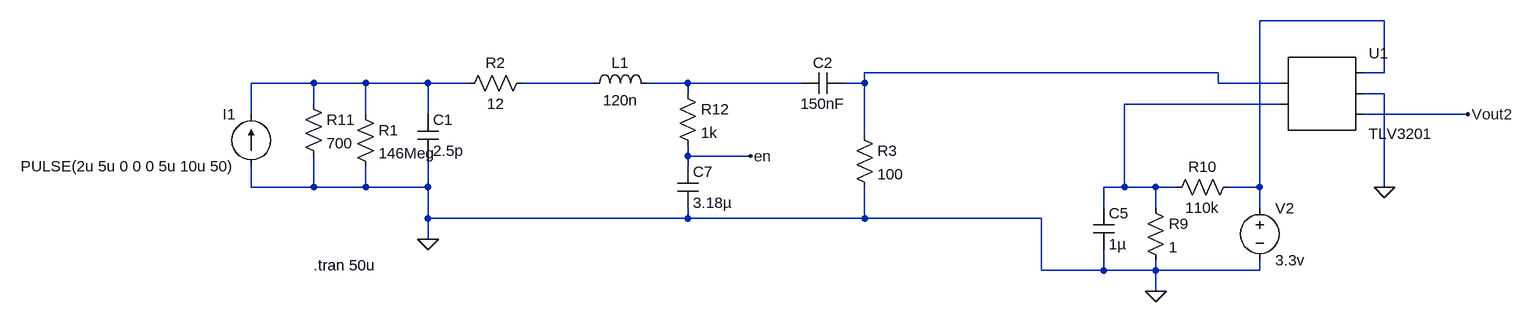
[diagram p0: schematic Draft1.asc]
Draft1.asc, the LTspice schematic file:
Version 4
SHEET 1 1968 736
WIRE 912 272 720 272
WIRE 656 352 112 352
WIRE 912 352 912 272
WIRE 912 352 880 352
WIRE -736 368 -832 368
WIRE -656 368 -736 368
WIRE -560 368 -656 368
WIRE -496 368 -560 368
WIRE -304 368 -416 368
WIRE -160 368 -224 368
WIRE 16 368 -160 368
WIRE 112 368 112 352
WIRE 112 368 80 368
WIRE 656 368 656 352
WIRE 752 368 656 368
WIRE -160 384 -160 368
WIRE 912 384 880 384
WIRE -736 400 -736 368
WIRE 752 400 512 400
WIRE -832 416 -832 368
WIRE -656 416 -656 368
WIRE -560 416 -560 368
WIRE 1040 416 880 416
WIRE 112 448 112 368
WIRE -160 480 -160 464
WIRE -64 480 -160 480
WIRE -160 496 -160 480
WIRE -832 528 -832 496
WIRE -736 528 -736 480
WIRE -736 528 -832 528
WIRE -656 528 -656 496
WIRE -656 528 -736 528
WIRE -560 528 -560 480
WIRE -560 528 -656 528
WIRE 512 528 512 400
WIRE 512 528 480 528
WIRE 560 528 512 528
WIRE 592 528 560 528
WIRE 720 528 720 272
WIRE 720 528 672 528
WIRE 912 528 912 384
WIRE 480 560 480 528
WIRE 560 560 560 528
WIRE 720 560 720 528
WIRE -560 576 -560 528
WIRE -160 576 -160 560
WIRE -160 576 -560 576
WIRE 112 576 112 528
WIRE 112 576 -160 576
WIRE 384 576 112 576
WIRE -560 608 -560 576
WIRE 384 656 384 576
WIRE 480 656 480 624
WIRE 480 656 384 656
WIRE 560 656 560 640
WIRE 560 656 480 656
WIRE 720 656 720 640
WIRE 720 656 560 656
WIRE 560 688 560 656
FLAG -560 608 0
FLAG 912 528 0
FLAG 560 688 0
FLAG 1040 416 Vout2
FLAG -64 480 en
SYMBOL res -672 400 R0
SYMATTR InstName R1
SYMATTR Value 146Meg
SYMBOL cap -576 416 R0
SYMATTR InstName C1
SYMATTR Value 2.5p
SYMBOL res -400 352 R90
WINDOW 0 0 56 VBottom 2
WINDOW 3 32 56 VTop 2
SYMATTR InstName R2
SYMATTR Value 12
SYMBOL current -832 496 R180
WINDOW 3 24 0 Left 2
WINDOW 0 24 80 Left 2
SYMATTR Value PULSE(2u 5u 0 0 0 5u 10u 50)
SYMATTR InstName I1
SYMATTR Value2 AC .5u 0
SYMBOL Cap 80 352 R90
WINDOW 0 0 32 VBottom 2
WINDOW 3 32 32 VTop 2
SYMATTR InstName C2
SYMATTR Value 150nF
SYMBOL ind -320 384 R270
WINDOW 0 32 56 VTop 2
WINDOW 3 5 56 VBottom 2
SYMATTR InstName L1
SYMATTR Value 120n
SYMBOL Res 96 432 R0
SYMATTR InstName R3
SYMATTR Value 100
SYMBOL AutoGenerated/TLV3201 816 384 R0
SYMATTR InstName U1
SYMBOL Cap 464 560 R0
SYMATTR InstName C5
SYMATTR Value 1µ
SYMBOL Res 544 544 R0
SYMATTR InstName R9
SYMATTR Value 1
SYMBOL Voltage 720 544 R0
SYMATTR InstName V2
SYMATTR Value 3.3v
SYMBOL Res 688 512 R90
WINDOW 0 0 56 VBottom 2
WINDOW 3 32 56 VTop 2
SYMATTR InstName R10
SYMATTR Value 110k
SYMBOL Res -752 384 R0
SYMATTR InstName R11
SYMATTR Value 700
SYMBOL Res -176 368 R0
SYMATTR InstName R12
SYMATTR Value 1k
SYMBOL Cap -176 496 R0
SYMATTR InstName C7
SYMATTR Value 3.18µ
TEXT -736 648 Left 2 !.tran 50u

The netlist it stands for:
* Draft1.asc
R1 N003 0 146Meg
C1 N003 0 2.5p
R2 N004 N003 12
I1 0 N003 PULSE(2u 5u 0 0 0 5u 10u 50) AC .5u 0
C2 N002 N005 150nF
L1 N004 N005 120n
R3 N002 0 100
* U1: TLV3201 (symbol AutoGenerated/TLV3201 not available, pins judged from their places): pin1=N002 pin2=N006 pin3=N001 pin4=0 pin5=Vout2
C5 N006 0 1µ
R9 N006 0 1
V2 N001 0 3.3v
R10 N001 N006 110k
R11 N003 0 700
R12 N005 en 1k
C7 en 0 3.18µ
.tran 50u
.backanno
.end